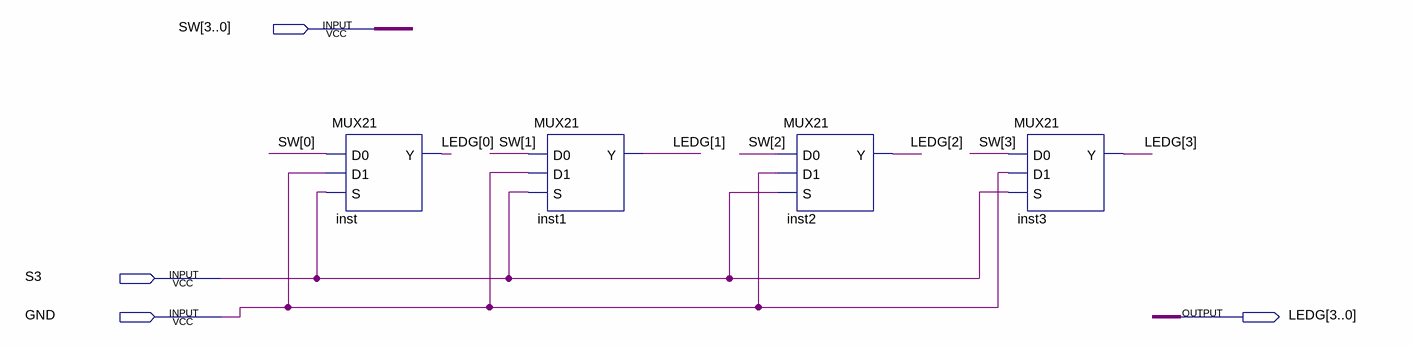
[diagram p0: schematic sheet]
// Quartus schematic MUX4_IN.bdf as structural Verilog: 4 symbols, 4 pins
module MUX4_IN (
  input  [3:0] SW,
  input  S3,
  input  GND,
  output [3:0] LEDG
);

  MUX21 inst (.D0(SW[0]), .D1(GND), .S(S3), .Y(LEDG[0]));
  MUX21 inst1 (.D0(SW[1]), .D1(GND), .S(S3), .Y(LEDG[1]));
  MUX21 inst2 (.D0(SW[2]), .D1(GND), .S(S3), .Y(LEDG[2]));
  MUX21 inst3 (.D0(SW[3]), .D1(GND), .S(S3), .Y(LEDG[3]));
endmodule
